# EAGLE schematic BIXS-V1.5 (EAGLE 9.6.2)
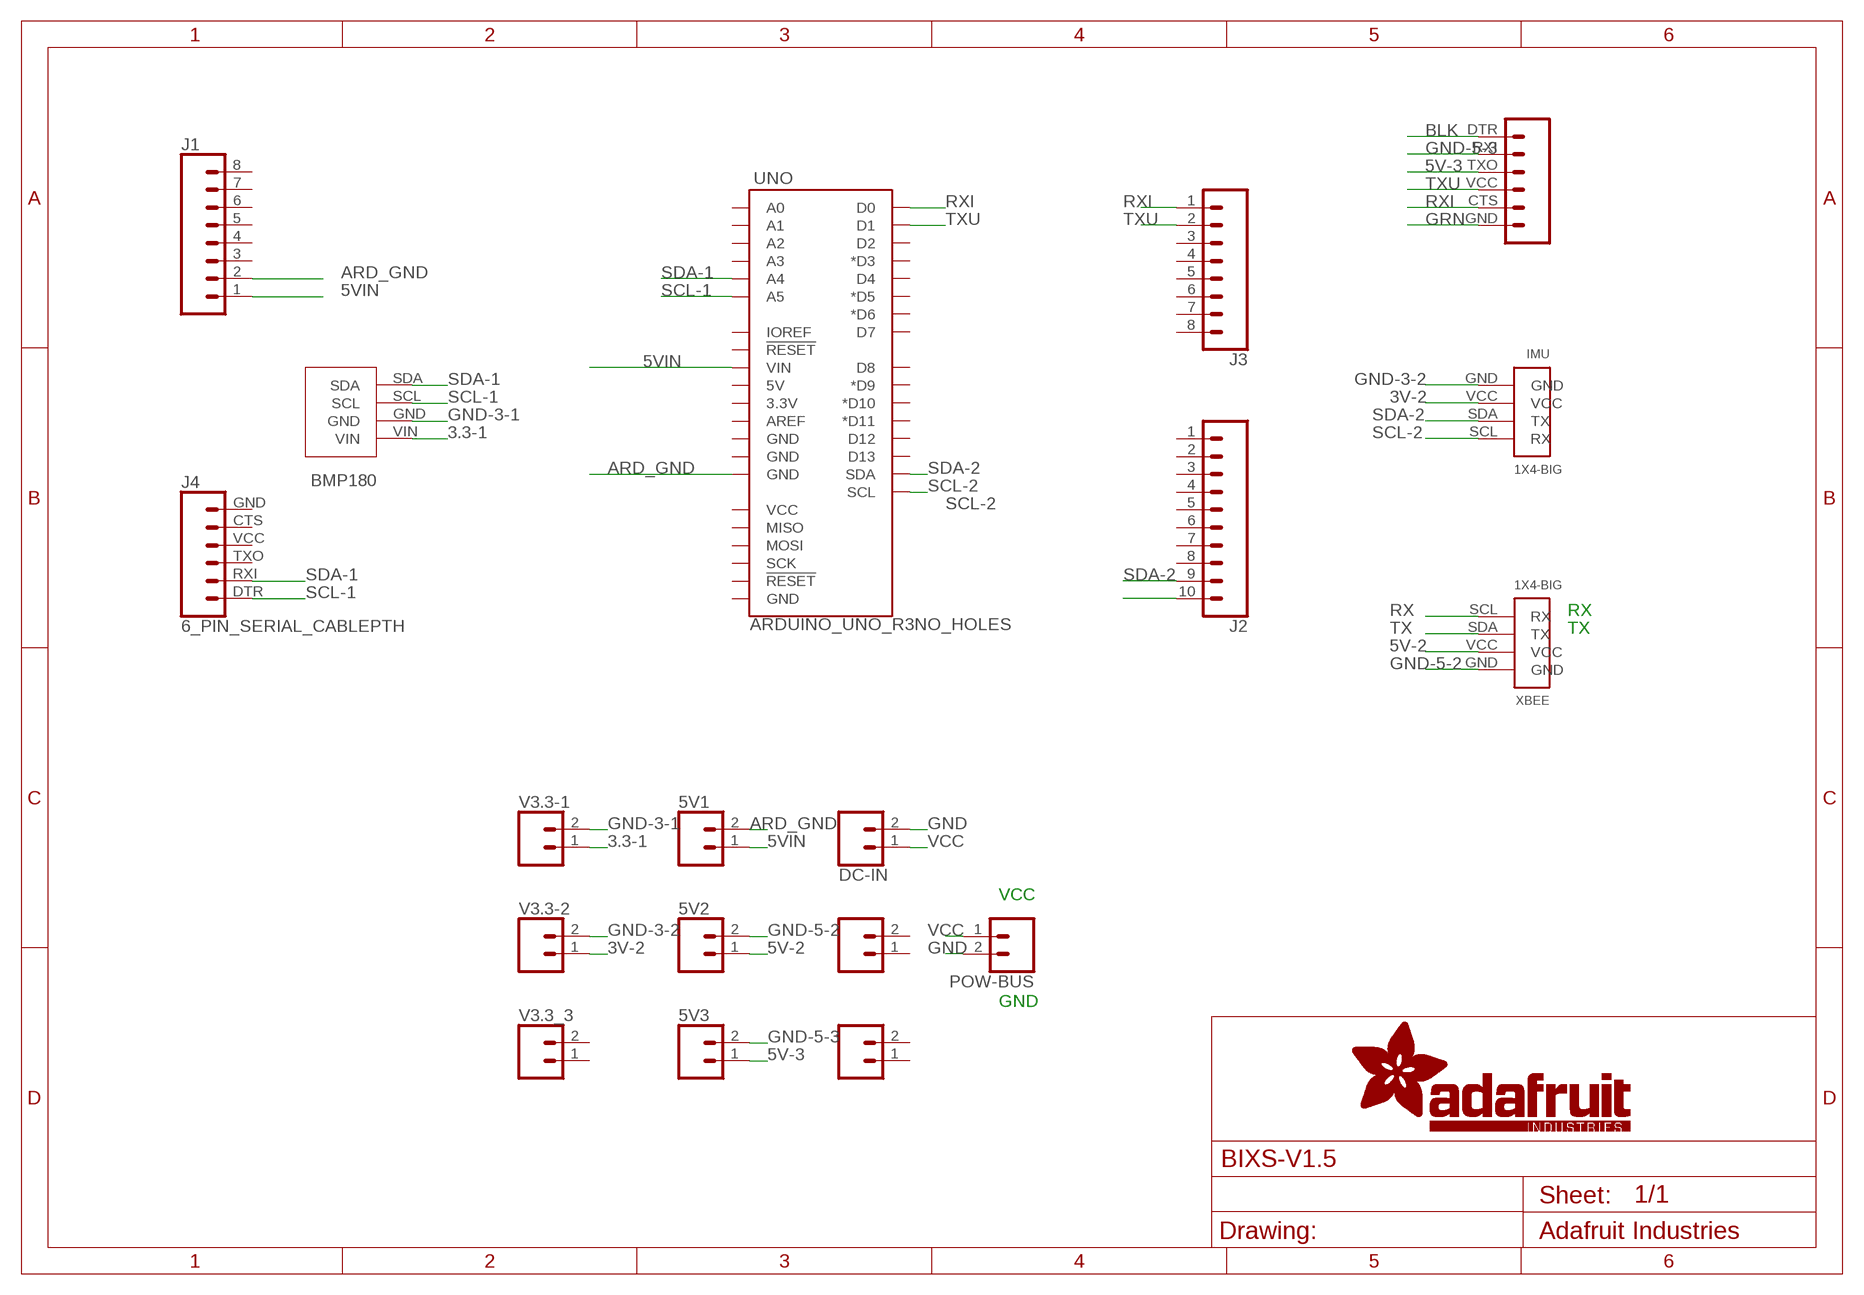
[diagram p0: schematic, sheet 1]

## Parts
5V1  CONN_02  [1X02]
5V2  CONN_02  [1X02]
5V3  CONN_02  [1X02]
BMP1  BMP180  [BMP180]
DC_1  CONN_02  [1X02]
DC_2  CONN_02  [1X02]
DC_IN  DC-IN  CONN_02  [1X02]
IMU  1X4-BIG  [1X04-BIG]
J1  CONN_08"  [1X08]
J2  CONN_10"  [1X10]
J3  CONN_08"  [1X08]
J4  6_PIN_SERIAL_CABLEPTH  [FTDI_BASIC]
MSD  6_PIN_SERIAL_CABLEPTH  [FTDI_BASIC]
POW-BUS  CONN_02  [1X02]
UNO  ARDUINO_UNO_R3NO_HOLES  [ARDUINO_R3_NO_HOLES]
V3.3-1  CONN_02  [1X02]
V3.3-2  CONN_02  [1X02]
V3.3_3  CONN_02  [1X02]
XBEE  1X4-BIG  [1X04-BIG]

## Nets
3.3-1: BMP1.VIN V3.3-1.1
3V-2: IMU.VCC V3.3-2.1
5V-2: 5V2.1 XBEE.VCC
5V-3: 5V3.1 MSD.TXO(VCC)
5VIN: 5V1.1 J1.1 UNO.VIN
ARD_GND: 5V1.2 J1.2 UNO.GND@2(GND)
BLK: MSD.DTR(BLK)
GND: DC_IN.2 POW-BUS.2
GND-3-1: BMP1.GND V3.3-1.2
GND-3-2: IMU.GND V3.3-2.2
GND-5-2: 5V2.2 XBEE.GND
GND-5-3: 5V3.2 MSD.RXI(GND)
GRN: MSD.GND(GRN)
RX: XBEE.SCL(RX)
RXI: J3.1 MSD.CTS(RXI) UNO.D0
SCL-1: BMP1.SCL J4.DTR(BLK) UNO.A5
SCL-2: IMU.SCL(RX) J2.10 UNO.SCL
SDA-1: BMP1.SDA J4.RXI(GND) UNO.A4
SDA-2: IMU.SDA(TX) J2.9 UNO.SDA
TX: XBEE.SDA(TX)
TXU: J3.2 MSD.VCC(TXU) UNO.D1
VCC: DC_IN.1 POW-BUS.1
Unconnected: DC_1.1 DC_1.2 DC_2.1 DC_2.2 J1.3 J1.4 J1.5 J1.6 J1.7 J1.8 J2.1 J2.2 J2.3 J2.4 J2.5 J2.6 J2.7 J2.8 J3.3 J3.4 J3.5 J3.6 J3.7 J3.8 J4.CTS(RXI) J4.GND(GRN) J4.TXO(VCC) J4.VCC(TXU) UNO.3.3V UNO.5V UNO.A0 UNO.A1 UNO.A2 UNO.A3 UNO.AREF UNO.D2 UNO.D3(*D3) UNO.D4 UNO.D5(*D5) UNO.D6(*D6) UNO.D7 UNO.D8 UNO.D9(*D9) UNO.D10(*D10) UNO.D11(*D11) UNO.D12 UNO.D13 UNO.GND@1(GND) UNO.GND@3(GND) UNO.GND@4(GND) UNO.IOREF UNO.MISO UNO.MOSI UNO.RESET@1(!RESET!) UNO.RESET@2(!RESET!) UNO.SCK UNO.VCC V3.3_3.1 V3.3_3.2

## Notes on the sheet
- RX
- TX
- VCC
- GND

## Library data of the parts
5V1-5V3 DC_1 DC_2 DC_IN POW-BUS V3.3-1 V3.3-2 V3.3_3 = SparkFun-Connectors:CONN_02: Multi connection point. Often used as Generic Header-pin footprint for 0.1 inch spaced/style header connections On any of the 0.1 inch spaced packages, you can populate with these: Break Away Headers - Straight <https://www.sparkfun.com/products/116> (PRT-00116) Break Away Male Headers - Right Angle <https://www.sparkfun.com/products/553> (PRT-00553) Female Headers <https://www.sparkfun.com/products/115> (PRT-00115) Break Away Headers - Machine Pin <https://www.sparkfun.com/products/117> (PRT-00117) Break Away Female Headers - Swiss Machine Pin <https://www.sparkfun.com/products/743> (PRT-00743) For SCREWTERMINALS and SPRING TERMINALS visit here: Screw Terimnals on SparkFun.com <https://www.sparkfun.com/search/results?term=Screw+Terminals> (5mm/3.5mm/2.54mm spacing) This device is also useful as a general connection point to wire up your design to another part of your project. Our various solder wires solder well into these plated through hole pads. Hook-Up Wire - Assortment (Stranded, 22 AWG) <https://www.sparkfun.com/products/11375> (PRT-11375) Hook-Up Wire - Assortment (Solid Core, 22 AWG) <https://www.sparkfun.com/products/11367> (PRT-11367) View the entire wire category on our website here <https://www.sparkfun.com/categories/141> Special notes: Molex polarized connector foot print use with: PRT-08233 with associated crimp pins and housings. 2.54_SCREWTERM for use with PRT-10571. 3.5mm Screw Terminal footprints for PRT-08084 5mm Screw Terminal footprints for use with PRT-08432
BMP1 = BMP180:BMP180
IMU XBEE = adafruit:1X4: 4-pin connector
J1 J3 = SparkFun-Connectors:CONN_08: Multi connection point. Often used as Generic Header-pin footprint for 0.1 inch spaced/style header connections On any of the 0.1 inch spaced packages, you can populate with these: Break Away Headers - Straight <https://www.sparkfun.com/products/116> (PRT-00116) Break Away Male Headers - Right Angle <https://www.sparkfun.com/products/553> (PRT-00553) Female Headers <https://www.sparkfun.com/products/115> (PRT-00115) Break Away Headers - Machine Pin <https://www.sparkfun.com/products/117> (PRT-00117) Break Away Female Headers - Swiss Machine Pin <https://www.sparkfun.com/products/743> (PRT-00743) Arduino Stackable Header - 8 Pin <https://www.sparkfun.com/products/9279> (PRT-09279) For SCREWTERMINALS and SPRING TERMINALS visit here: Screw Terimnals on SparkFun.com <https://www.sparkfun.com/search/results?term=Screw+Terminals> (5mm/3.5mm/2.54mm spacing) This device is also useful as a general connection point to wire up your design to another part of your project. Our various solder wires solder well into these plated through hole pads. Hook-Up Wire - Assortment (Stranded, 22 AWG) <https://www.sparkfun.com/products/11375> (PRT-11375) Hook-Up Wire - Assortment (Solid Core, 22 AWG) <https://www.sparkfun.com/products/11367> (PRT-11367) View the entire wire category on our website here <https://www.sparkfun.com/categories/141> Special notes: Molex polarized connector foot print use with SKU : PRT-08231 with associated crimp pins and housings. 1MM SMD Version SKU: PRT-10208 NOTES ON THE VARIANTS LOCK and LOCK_LONGPADS... This footprint was designed to help hold the alignment of a through-hole component (i.e. 6-pin header) while soldering it into place. You may notice that each hole has been shifted either up or down by 0.005 of an inch from it's more standard position (which is a perfectly straight line). This slight alteration caused the pins (the squares in the middle) to touch the edges of the holes. Because they are alternating, it causes a "brace" to hold the component in place. 0.005 has proven to be the perfect amount of "off-center" position when using our standard breakaway headers. Although looks a little odd when you look at the bare footprint, once you have a header in there, the alteration is very hard to notice. Also,if you push a header all the way into place, it is covered up entirely on the bottom side.; PROD_ID: CONN-08438
J2 = SparkFun-Connectors:CONN_10: Multi connection point. Often used as Generic Header-pin footprint for 0.1 inch spaced/style header connections On any of the 0.1 inch spaced packages, you can populate with these: Break Away Headers - Straight <https://www.sparkfun.com/products/116> (PRT-00116) Break Away Male Headers - Right Angle <https://www.sparkfun.com/products/553> (PRT-00553) Female Headers <https://www.sparkfun.com/products/115> (PRT-00115) Break Away Headers - Machine Pin <https://www.sparkfun.com/products/117> (PRT-00117) Break Away Female Headers - Swiss Machine Pin <https://www.sparkfun.com/products/743> (PRT-00743) Arduino Stackable Header - 10 Pin <https://www.sparkfun.com/products/11376> (PRT-11376) For SCREWTERMINALS and SPRING TERMINALS visit here: Screw Terimnals on SparkFun.com <https://www.sparkfun.com/search/results?term=Screw+Terminals> (5mm/3.5mm/2.54mm spacing) This device is also useful as a general connection point to wire up your design to another part of your project. Our various solder wires solder well into these plated through hole pads. Hook-Up Wire - Assortment (Stranded, 22 AWG) <https://www.sparkfun.com/products/11375> (PRT-11375) Hook-Up Wire - Assortment (Solid Core, 22 AWG) <https://www.sparkfun.com/products/11367> (PRT-11367) View the entire wire category on our website here <https://www.sparkfun.com/categories/141> Special notes: Molex polarized connector foot print use with SKU : PRT-08231 with associated crimp pins and housings. 1MM SMD Version SKU: PRT-10208 NOTES ON THE VARIANTS LOCK and LOCK_LONGPADS... This footprint was designed to help hold the alignment of a through-hole component (i.e. 6-pin header) while soldering it into place. You may notice that each hole has been shifted either up or down by 0.005 of an inch from it's more standard position (which is a perfectly straight line). This slight alteration caused the pins (the squares in the middle) to touch the edges of the holes. Because they are alternating, it causes a "brace" to hold the component in place. 0.005 has proven to be the perfect amount of "off-center" position when using our standard breakaway headers. Although looks a little odd when you look at the bare footprint, once you have a header in there, the alteration is very hard to notice. Also,if you push a header all the way into place, it is covered up entirely on the bottom side.; PROD_ID: CONN-11563
J4 MSD = SparkFun-Connectors:6_PIN_SERIAL_CABLE: 6-pin header connection for use with the "FTDI BASIC" pinout - CABLE SIDE. Also known as "Arduino Serial Program Header". This is used on a design to provide a 6-pin connection point for serial communication usually from a USB cable (D+/D-) to these headers (RX/TX). It also has the remaining pins necessary for programming in the Arduino evironment (DTR, GND, and sometimes VCC). Note, this device has "CABLE" in the name. It is intended to be used on a design that usually lives on the end of your USB cable and prvides the converter chip (FTDI232 or FTDI231x) to commnicate serial RX/TX. The "sister" device, named "TARGET" is inteneded to be used on a design that contains a target micro-controller that you wish to program. You can populate with some of these: Female Headers <https://www.sparkfun.com/products/115> (PRT-00115) For reference (or to suit your programming needs) check out these designs: SparkFun FTDI Basic Breakout - 5V <https://www.sparkfun.com/products/9716> (DEV-09716) SparkFun FTDI Basic Breakout - 3.3V <https://www.sparkfun.com/products/9873> (DEV-09873) SparkFun FTDI SmartBasic <https://www.sparkfun.com/products/12935> (DEV-12935) SparkFun Beefy 3 - FTDI Basic Breakout <https://www.sparkfun.com/products/13746> (DEV-13746)
UNO = SparkFun-Boards:ARDUINO_UNO_R3: Arduino R3 Footprint with SPI header Arduino Uno R3 Compatible Footprint. Matches PCB size of the original board. SparkFun Products: SAMD21 Dev Breakout <https://www.sparkfun.com/products/13672> RedBoard <https://www.sparkfun.com/products/12757> R3 Stackable Headers <https://www.sparkfun.com/products/11417>